# EAGLE board XMICRO-SERIAL V1.1 (EAGLE 6.3)
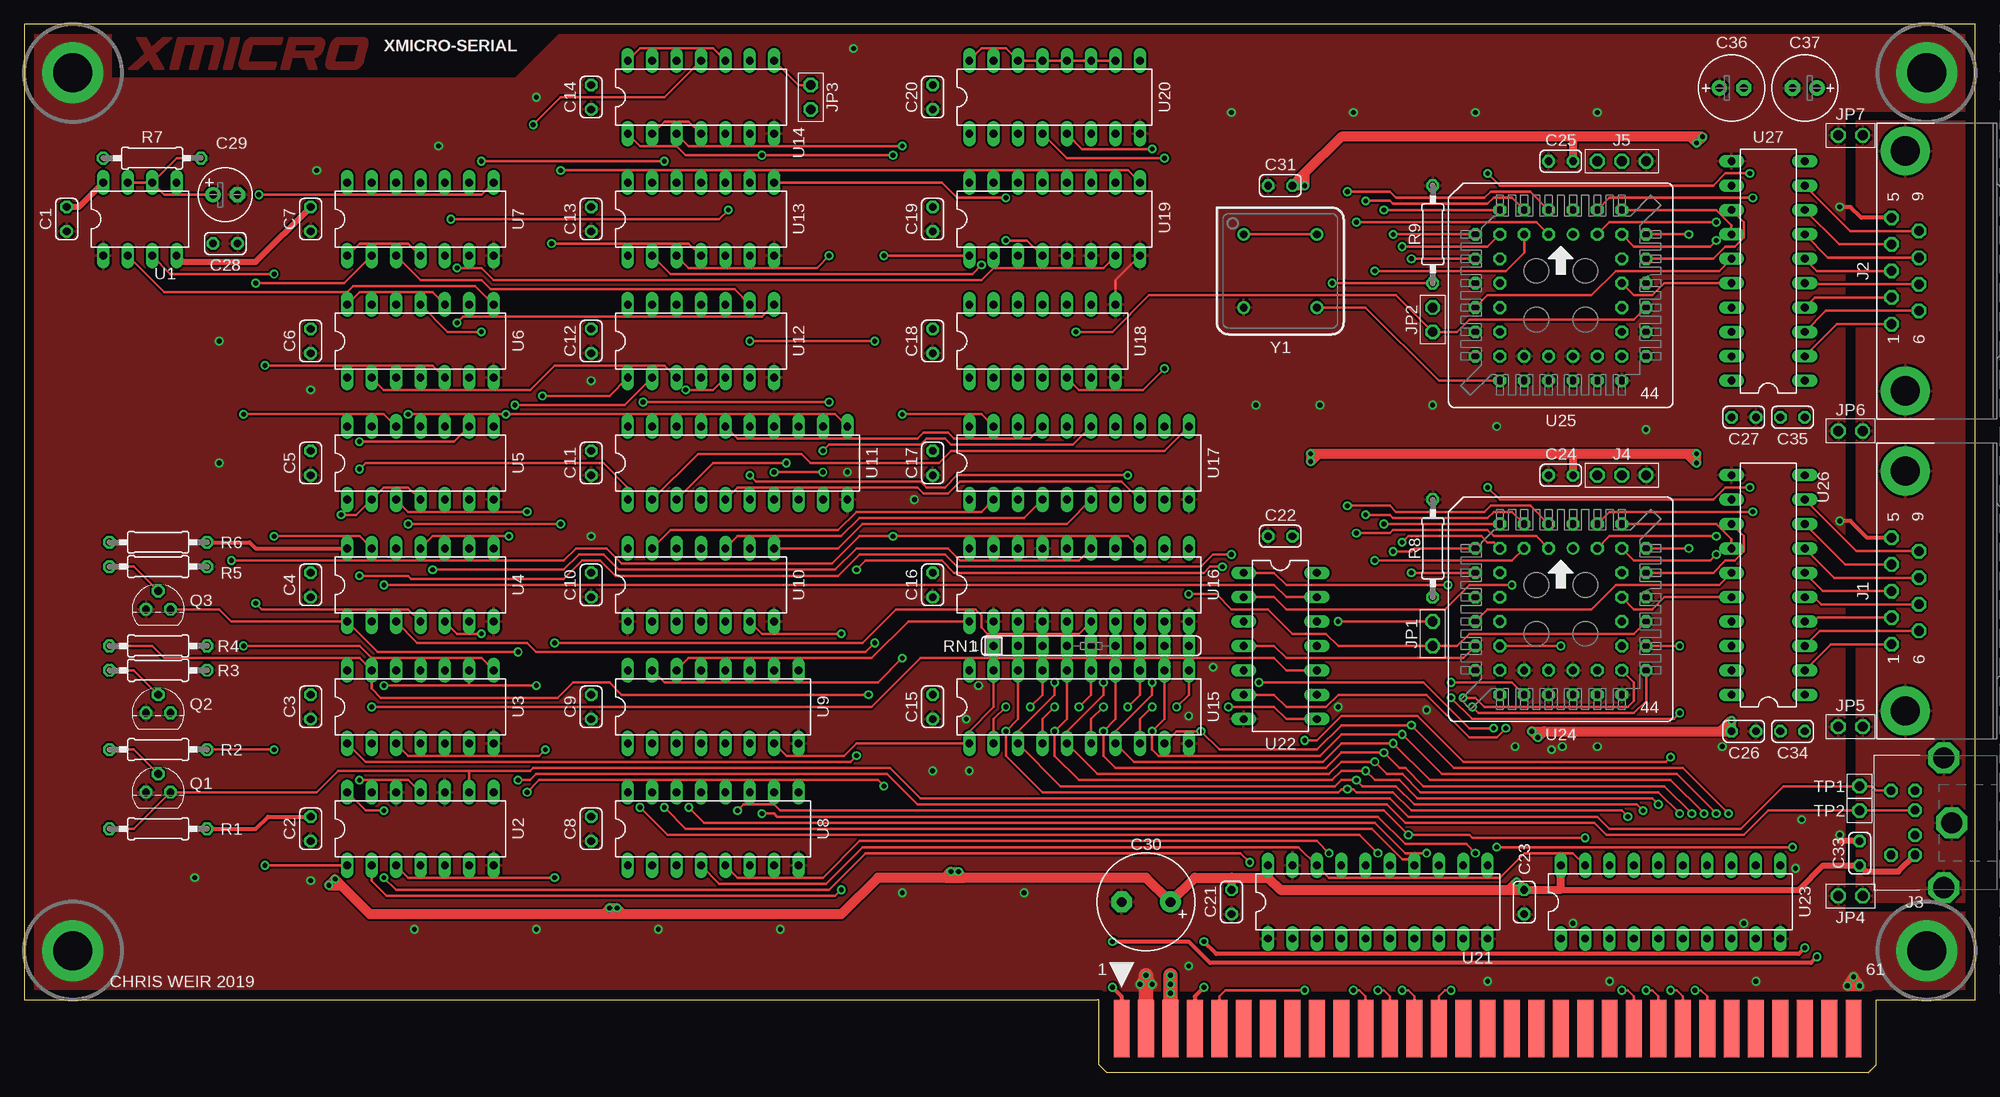
[diagram p6: board, top side]
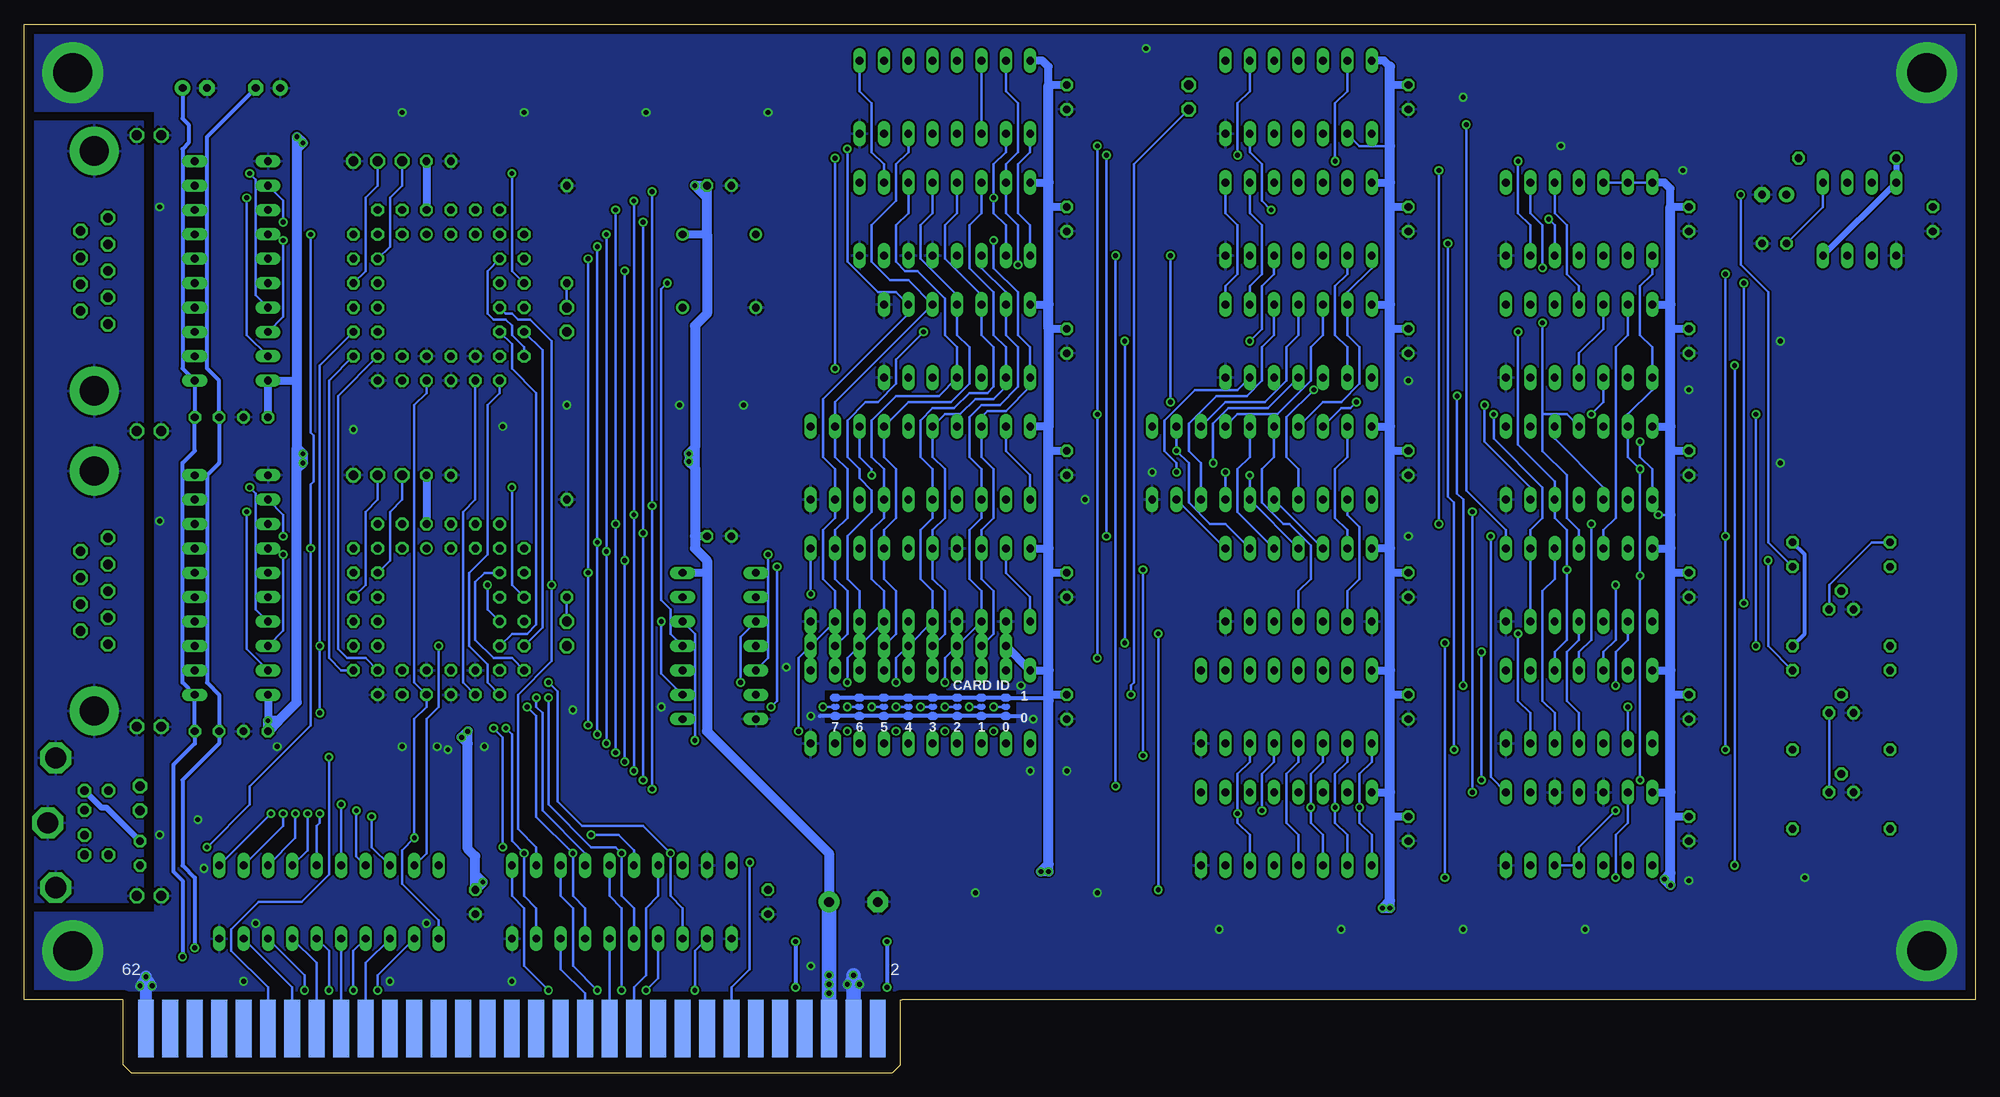
[diagram p7: board, bottom side, seen from below]

Size 203.2 x 109.22 mm. Coordinates in mm from the lower left corner, seen from the top.
Outline: 111.76,7.62 0,7.62 0,109.22 203.2,109.22 203.2,7.62 193.04,7.62
Copper layers (1*16): Top 0.035mm / dielectric 1.5mm / Bottom 0.035mm
Design rules "default *": minimum track width 6mil, minimum drill 0.3mm, track to track 8mil, track to pad 8mil, pad to pad 8mil, via to via 8mil, smd to smd 8mil, copper to edge 40mil, drill to drill 10mil, minimum pad ring 10mil, minimum via ring 8mil, stop-mask expansion 3mil, vias tented up to drill 30mil, thermal gap 10mil
Net classes: 0 default: width 0.254 mm; 1 GND: width 0.254 mm, clearance 0.254 mm to class 0; 2 SHIELD: width 0.254 mm, clearance 0.762 mm to class 0, clearance 0.762 mm to class 1; 3 SUPPLY: width 0.254 mm, clearance 0.381 mm to class 0, clearance 0.381 mm to class 1, clearance 0.762 mm to class 2, clearance 0.381 mm; 4 LOGO: width 0.152 mm
bRestrict: area 100,36.5 to 119.7,39.7

## Footprints (pad centres in the part's own frame; a part is rotated, then mirrored left to right if it is on the bottom)
C100 = drill 0.8 octagon: P$1 -1.27,0; P$2 1.27,0
E2,5-6 = drill 0.813 pad 1.6: + -1.27,0 | drill 0.813 pad 1.6 octagon: - 1.27,0
C-10-5 = drill 1.016 pad 2.184: + -2.54,0 | drill 1.016 pad 2.184 octagon: - 2.54,0
E2,5-7 = drill 0.813 pad 1.6: + -1.27,0 | drill 0.813 pad 1.6 octagon: - 1.27,0
EDGE62M = smd 1.651 x 5.969: 1 -38.1,-3.01; 3 -35.56,-3.01; 5 -33.02,-3.01; 7 -30.48,-3.01; 9 -27.94,-3.01; 11 -25.4,-3.01; 13 -22.86,-3.01; 15 -20.32,-3.01; 17 -17.78,-3.01; 19 -15.24,-3.01; 21 -12.7,-3.01; 23 -10.16,-3.01; 25 -7.62,-3.01; 27 -5.08,-3.01; 29 -2.54,-3.01; 31 0,-3.01; 33 2.54,-3.01; 35 5.08,-3.01; 37 7.62,-3.01; 39 10.16,-3.01; 41 12.7,-3.01; 43 15.24,-3.01; 45 17.78,-3.01; 47 20.32,-3.01; 49 22.86,-3.01; 51 25.4,-3.01; 53 27.94,-3.01; 55 30.48,-3.01; 57 33.02,-3.01; 59 35.56,-3.01; 61 38.1,-3.01 | smd 1.651 x 5.969 bottom: 2 -38.1,-3.01; 4 -35.56,-3.01; 6 -33.02,-3.01; 8 -30.48,-3.01; 10 -27.94,-3.01; 12 -25.4,-3.01; 14 -22.86,-3.01; 16 -20.32,-3.01; 18 -17.78,-3.01; 20 -15.24,-3.01; 22 -12.7,-3.01; 24 -10.16,-3.01; 26 -7.62,-3.01; 28 -5.08,-3.01; 30 -2.54,-3.01; 32 0,-3.01; 34 2.54,-3.01; 36 5.08,-3.01; 38 7.62,-3.01; 40 10.16,-3.01; 42 12.7,-3.01; 44 15.24,-3.01; 46 17.78,-3.01; 48 20.32,-3.01; 50 22.86,-3.01; 52 25.4,-3.01; 54 27.94,-3.01; 56 30.48,-3.01; 58 33.02,-3.01; 60 35.56,-3.01; 62 38.1,-3.01
D9-H = drill 1 octagon: P$1 -5.54,1.42; P$2 -2.77,1.42; P$3 0,1.42; P$4 2.77,1.42; P$5 5.54,1.42; P$6 -4.155,-1.42; P$7 -1.385,-1.42; P$8 1.385,-1.42; P$9 4.155,-1.42 | drill 3.05 pad 5.08: S1 -12.495,0; S2 12.495,0
MINI-DIN6 = drill 0.9 octagon: 1 -1.3,-2.16; 2 1.3,-2.16; 3 -3.35,-2.16; 4 3.35,-2.16; 5 -3.35,-4.65; 6 3.35,-4.65 | drill 2.2 octagon: G$1 6.76,0.84; G$2 -6.76,0.84; G$3 0,1.65
1X03 = drill 1.016 octagon: 1 -2.54,0; 2 0,0; 3 2.54,0
1X02 = drill 1.016 octagon: 1 -1.27,0; 2 1.27,0
TO92 = drill 0.813 octagon: 1 -1.27,0; 2 0,1.905; 3 1.27,0
0207/10 = drill 0.813 octagon: 1 -5.08,0; 2 5.08,0
SIL9 = drill 0.813 long: 1 -10.16,0; 2 -7.62,0; 3 -5.08,0; 4 -2.54,0; 5 0,0; 6 2.54,0; 7 5.08,0; 8 7.62,0; 9 10.16,0
1X01 = drill 1.016 octagon: 1 0,0
DIL-08 = drill 0.813 long: 1 -3.81,-3.81; 2 -1.27,-3.81; 3 1.27,-3.81; 4 3.81,-3.81; 5 3.81,3.81; 6 1.27,3.81; 7 -1.27,3.81; 8 -3.81,3.81
DIL14 = drill 0.813 long: 1 -7.62,-3.81; 2 -5.08,-3.81; 3 -2.54,-3.81; 4 0,-3.81; 5 2.54,-3.81; 6 5.08,-3.81; 7 7.62,-3.81; 8 7.62,3.81; 9 5.08,3.81; 10 2.54,3.81; 11 0,3.81; 12 -2.54,3.81; 13 -5.08,3.81; 14 -7.62,3.81
DIL16 = drill 0.813 long: 1 -8.89,-3.81; 2 -6.35,-3.81; 3 -3.81,-3.81; 4 -1.27,-3.81; 5 1.27,-3.81; 6 3.81,-3.81; 7 6.35,-3.81; 8 8.89,-3.81; 9 8.89,3.81; 10 6.35,3.81; 11 3.81,3.81; 12 1.27,3.81; 13 -1.27,3.81; 14 -3.81,3.81; 15 -6.35,3.81; 16 -8.89,3.81
DIL20 = drill 0.813 long: 1 -11.43,-3.81; 2 -8.89,-3.81; 3 -6.35,-3.81; 4 -3.81,-3.81; 5 -1.27,-3.81; 6 1.27,-3.81; 7 3.81,-3.81; 8 6.35,-3.81; 9 8.89,-3.81; 10 11.43,-3.81; 11 11.43,3.81; 12 8.89,3.81; 13 6.35,3.81; 14 3.81,3.81; 15 1.27,3.81; 16 -1.27,3.81; 17 -3.81,3.81; 18 -6.35,3.81; 19 -8.89,3.81; 20 -11.43,3.81
S44 = drill 0.813: 1 1.27,6.35 | drill 0.813 octagon: 2 -1.27,8.89; 3 -1.27,6.35; 4 -3.81,8.89; 5 -3.81,6.35; 6 -6.35,8.89; 7 -8.89,6.35; 8 -6.35,6.35; 9 -8.89,3.81; 10 -6.35,3.81; 11 -8.89,1.27; 12 -6.35,1.27; 13 -8.89,-1.27; 14 -6.35,-1.27; 15 -8.89,-3.81; 16 -6.35,-3.81; 17 -8.89,-6.35; 18 -6.35,-8.89; 19 -6.35,-6.35; 20 -3.81,-8.89; 21 -3.81,-6.35; 22 -1.27,-8.89; 23 -1.27,-6.35; 24 1.27,-8.89; 25 1.27,-6.35; 26 3.81,-8.89; 27 3.81,-6.35; 28 6.35,-8.89; 29 8.89,-6.35; 30 6.35,-6.35; 31 8.89,-3.81; 32 6.35,-3.81; 33 8.89,-1.27; 34 6.35,-1.27; 35 8.89,1.27; 36 6.35,1.27; 37 8.89,3.81; 38 6.35,3.81; 39 8.89,6.35; 40 6.35,8.89; 41 6.35,6.35; 42 3.81,8.89; 43 3.81,6.35; 44 1.27,8.89
DIL08S = drill 0.813: 1 -3.81,-3.81; 4 3.81,-3.81; 5 3.81,3.81; 8 -3.81,3.81

## Placement (x,y rotation side)
C1  0.1uF  [C100]  4.45,88.9 270 top
C2  0.1uF  [C100]  29.84,25.4 270 top
C3  0.1uF  [C100]  29.84,38.1 270 top
C4  0.1uF  [C100]  29.84,50.8 270 top
C5  0.1uF  [C100]  29.84,63.5 270 top
C6  0.1uF  [C100]  29.84,76.2 270 top
C7  0.1uF  [C100]  29.84,88.9 270 top
C8  0.1uF  [C100]  59.05,25.4 270 top
C9  0.1uF  [C100]  59.05,38.1 270 top
C10  0.1uF  [C100]  59.05,50.8 270 top
C11  0.1uF  [C100]  59.05,63.5 270 top
C12  0.1uF  [C100]  59.05,76.2 270 top
C13  0.1uF  [C100]  59.05,88.9 270 top
C14  0.1uF  [C100]  59.05,101.6 270 top
C15  0.1uF  [C100]  94.61,38.1 270 top
C16  0.1uF  [C100]  94.61,50.8 270 top
C17  0.1uF  [C100]  94.61,63.5 270 top
C18  0.1uF  [C100]  94.61,76.2 270 top
C19  0.1uF  [C100]  94.61,88.9 270 top
C20  0.1uF  [C100]  94.61,101.6 270 top
C21  0.1uF  [C100]  125.73,17.78 270 top
C22  0.1uF  [C100]  130.81,55.88 180 top
C23  0.1uF  [C100]  156.21,17.78 270 top
C24  0.1uF  [C100]  160.02,62.23 180 top
C25  0.1uF  [C100]  160.02,94.93 180 top
C26  0.1uF  [C100]  179.07,35.56 0 top
C27  0.1uF  [C100]  179.07,68.26 0 top
C28  10nF  [C100]  20.95,86.36 0 top
C29  0.1uF  [E2,5-6]  20.95,91.44 0 top
C30  220uF  [C-10-5]  116.84,17.78 180 top
C31  0.1uF  [C100]  130.81,92.39 180 top
C33  0.1uF  [C100]  191.13,22.86 90 top
C34  0.1uF  [C100]  184.15,35.56 180 top
C35  0.1uF  [C100]  184.15,68.26 180 top
C36  100uF  [E2,5-7]  177.8,102.55 0 top
C37  100uF  [E2,5-7]  185.42,102.55 180 top
CE0  XMICRO-BUS-EDGE62M  [EDGE62M]  152.4,7.62 0 top
J1  D9-MPH  [D9-H]  195.9,50.16 90 top
J2  D9-MPH  [D9-H]  195.9,83.5 90 top
J3  MINI-DIN6  [MINI-DIN6]  199.07,26.04 270 top
J4  PINHD1X3  [1X03]  166.37,62.23 0 top
J5  PINHD1X3  [1X03]  166.37,94.93 0 top
JP1  PINHD-1X2THRU  [1X02]  146.69,45.72 90 top
JP2  PINHD-1X2THRU  [1X02]  146.69,78.42 90 top
JP3  PINHD-1X2THRU  [1X02]  81.92,101.6 270 top
JP4  PINHD-1X2THRU  [1X02]  190.18,18.41 0 top
JP5  PINHD-1X2THRU  [1X02]  190.18,36.04 0 top
JP6  PINHD-1X2THRU  [1X02]  190.18,66.83 0 top
JP7  PINHD-1X2THRU  [1X02]  190.18,97.63 0 top
Q1  2N5088  [TO92]  13.97,29.21 0 top
Q2  2N5088  [TO92]  13.97,37.46 0 top
Q3  2N5088  [TO92]  13.97,48.26 0 top
R1  10k  [0207/10]  13.97,25.4 0 top
R2  100k  [0207/10]  13.97,33.66 180 top
R3  100k  [0207/10]  13.97,41.91 180 top
R4  10k  [0207/10]  13.97,44.45 0 top
R5  100k  [0207/10]  13.97,52.7 180 top
R6  10k  [0207/10]  13.97,55.24 0 top
R7  1.2k  [0207/10]  13.34,95.25 0 top
R8  10k  [0207/10]  146.69,54.61 270 top
R9  10k  [0207/10]  146.69,87.31 270 top
RN1  10k  [SIL9]  111.12,44.45 0 top
TP1  PINHD-1X1  [1X01]  191.13,29.85 90 top
TP2  PINHD-1X1  [1X01]  191.13,27.3 90 top
U1  555  [DIL-08]  12.06,88.9 0 top
U2  7486  [DIL14]  41.27,25.4 0 top
U3  7410  [DIL14]  41.27,38.1 0 top
U4  7404  [DIL14]  41.27,50.8 0 top
U5  7474  [DIL14]  41.27,63.5 0 top
U6  7474  [DIL14]  41.27,76.2 0 top
U7  7408  [DIL14]  41.27,88.9 0 top
U8  74138  [DIL16]  71.75,25.4 0 top
U9  74138  [DIL16]  71.75,38.1 0 top
U10  74280  [DIL14]  70.48,50.8 0 top
U11  74273  [DIL20]  74.3,63.5 0 top
U12  74164  [DIL14]  70.48,76.2 0 top
U13  74164  [DIL14]  70.48,88.9 0 top
U14  7474  [DIL14]  70.48,101.6 0 top
U15  74244  [DIL20]  109.86,38.1 0 top
U16  74244  [DIL20]  109.86,50.8 0 top
U17  74240  [DIL20]  109.86,63.5 0 top
U18  74280  [DIL14]  106.05,76.2 0 top
U19  74165  [DIL16]  107.31,88.9 0 top
U20  74165  [DIL16]  107.31,101.6 0 top
U21  74244  [DIL20]  140.97,17.78 0 top
U22  7404  [DIL14]  130.81,44.45 270 top
U23  74245  [DIL20]  171.45,17.78 0 top
U24  16550  [S44]  160.02,48.26 0 top
U25  16550  [S44]  160.02,80.96 0 top
U26  75185  [DIL20]  181.61,50.8 90 top
U27  75185  [DIL20]  181.61,83.5 90 top
Y1  1.8432MHz  [DIL08S]  130.81,83.5 270 top

## Tracks (layer width: path | path; a pad name or v marks a point on that pad's centre or on a via)
!BCSX  (via drill 0.5)
  Top 0.254: CE0.9 124.46,7.94 125.09,8.57 v133.35,8.57
  Bottom 0.254: v133.35,8.57 133.35,12.7 U21.2
!BRD  (via drill 0.5)
  Top 0.254: CE0.21 139.7,7.94 139.06,8.57 v138.43,8.57
  Bottom 0.254: v138.43,8.57 137.16,9.84 U21.4
!BRST  (via drill 0.5)
  Top 0.254: v127.64,21.91 126.68,22.86 87.63,22.86 83.82,19.05 38.73,19.05 v37.47,20.32
  Bottom 0.254: CE0.14 129.54,8.89 127.64,10.79 v127.64,21.91 | v37.47,20.32 37.47,24.77 36.2,26.04 U2.13
!BWR
  Bottom 0.254: CE0.22 139.7,8.89 138.43,10.16 138.43,17.14 137.16,18.41 U21.17
!CS_IDR
  Top 0.254: U15.19 100.97,38.1 98.42,35.56 U15.1 86.68,34.29 85.41,33.02 79.38,33.02 U9.7
!CS_KBR  (via drill 0.5)
  Top 0.254: U14.3 69.22,96.52 v91.44,96.52 | v91.44,68.58 99.69,68.58 U17.19 | U9.15 66.67,40.64 88.9,40.64 v91.44,43.18
  Bottom 0.254: v91.44,96.52 v91.44,68.58 v91.44,43.18 | U17.1 98.42,62.23 100.97,64.77 U17.19
!CS_KBW  (via drill 0.5)
  Top 0.254: U8.15 65.41,30.48 | 65.41,30.48 88.9,30.48 v89.53,29.85 | v89.53,85.09 U19.1 | U5.3 40.01,58.42 v52.39,58.42 | v52.39,29.21 53.66,30.48 65.41,30.48
  Bottom 0.254: U19.1 98.42,88.27 99.69,89.54 99.69,94.62 98.42,95.89 U20.1 | v89.53,29.85 v89.53,85.09 | U5.3 38.73,60.96 43.81,66.04 U5.10 | v52.39,58.42 v52.39,29.21
!CS_STR
  Top 0.254: U16.1 92.08,46.99 88.27,43.18 69.22,43.18 U9.14
  Bottom 0.254: U16.1 98.42,49.53 100.97,52.07 U16.19
!CSX  (via drill 0.5)
  Top 0.254: v160.02,44.45 U24.16 | U23.19 161.29,22.86 156.21,22.86 153.67,20.32 135.89,20.32 U21.18 132.72,23.5 87.31,23.5 83.5,19.68 72.39,19.68 U8.4
  Bottom 0.254: U9.4 70.48,32.38 71.75,31.12 71.75,26.04 70.48,24.77 U8.4 | U25.16 152.4,75.88 152.4,73.34 149.86,70.8 149.86,46.67 150.81,45.72 152.4,45.72 U24.16 | U23.19 161.29,22.86 161.29,36.83 160.02,38.1 v160.02,44.45
!INT_KB
  Top 0.254: U14.8 80.64,102.87 JP3.1
!IRQX  (via drill 0.5)
  Top 0.254: v133.35,34.61 134.62,34.61 137.16,37.15 145.1,37.15 149.86,32.38 170.97,32.38 v171.45,32.86
  Bottom 0.254: CE0.52 177.8,8.89 181.61,12.7 181.61,14.92 178.75,17.78 174.31,17.78 171.45,20.64 v171.45,32.86 | v133.35,34.61 133.35,45.72 U22.12
!KB_DATA  (via drill 0.5)
  Top 0.254: U12.1 60.96,70.48 v53.98,70.48 | v37.47,40.32 46.35,40.32 | 46.35,40.32 U3.9 | v53.34,40.32 46.35,40.32
  Bottom 0.254: U4.2 36.2,45.09 37.47,43.81 v37.47,40.32 | v53.98,70.48 53.98,60.32 53.34,59.69 v53.34,40.32
!KB_WRCYCLE  (via drill 0.5)
  Top 0.254: U13.2 67.31,83.19 98.74,83.19 v99.69,84.14 | U12.2 62.55,69.53 v51.12,69.53
  Bottom 0.254: U20.15 100.97,102.23 99.69,100.97 99.69,95.89 100.97,94.62 U19.15 100.97,89.54 99.69,88.27 v99.69,84.14 | U12.2 65.41,75.56 66.67,76.84 66.67,81.92 65.41,83.19 U13.2 | v51.12,69.53 51.12,65.72 46.35,60.96 U5.6
!RD  (via drill 0.5)
  Top 0.254: v162.56,24.45 150.81,24.45 150.5,24.77 v144.15,24.77 141.6,27.3 78.74,27.3 78.11,27.94 74.93,27.94 v74.3,27.3
  Bottom 0.254: U25.24 161.29,70.8 162.56,69.53 162.56,40.64 U24.24 161.29,38.1 162.56,36.83 v162.56,24.45 163.83,23.18 163.83,19.68 160.02,15.88 U23.1 | v144.15,24.77 141.29,24.77 139.7,23.18 U21.16 | U9.5 73.03,32.38 74.3,31.12 v74.3,27.3
!RST  (via drill 0.5)
  Top 0.254: U7.1 34.92,86.36 40.01,86.36 U7.4 | U11.1 62.87,60.96 60.33,63.5 35.56,63.5 v34.92,62.86 | v34.92,30.48 40.01,30.48 U2.11 | v125.73,53.97 123.83,53.97 122.56,52.7 97.16,52.7 95.89,53.97 87,53.97 84.77,51.75 61.59,51.75 60.01,53.34 58.1,53.34 56.2,51.43 40.32,51.43 40.01,51.75 v34.92,51.75
  Bottom 0.254: U7.1 33.66,83.19 34.92,81.92 34.92,76.84 33.66,75.56 U6.1 33.66,71.12 36.2,68.58 U5.13 36.2,64.14 v34.92,62.86 v34.92,51.75 v34.92,30.48 | U22.5 125.73,43.18 v125.73,53.97
!WR  (via drill 0.5)
  Top 0.254: v148.59,40.64 154.94,40.64 U24.20 | v135.89,22.86 134.62,24.13 87,24.13 83.19,20.32 74.3,20.32 U8.5
  Bottom 0.254: U21.3 134.62,17.14 135.89,18.41 v135.89,22.86 138.75,25.72 145.1,25.72 147.64,28.26 147.64,39.69 v148.59,40.64 | U25.20 156.21,59.69 157.48,58.42 157.48,40.64 U24.20
+12V  (via drill 0.5)
  Top 0.406: v186.69,12.07 186.06,11.43 123.51,11.43 121.28,13.65 v113.35,13.65 | v113.35,8.89 114.3,7.94 CE0.1
  Bottom 0.406: v186.69,12.07 186.69,20 187.64,20.96 187.64,32.07 185.42,34.29 C34.P$1 U26.1 186.69,40.64 186.69,63.5 185.42,64.77 C35.P$1 U27.1 186.69,73.34 186.69,96.2 186.06,96.84 186.06,98.74 186.69,99.38 C37.+ | v113.35,13.65 v113.35,8.89
-12V  (via drill 0.5)
  Top 0.406: v185.42,13.02 184.78,12.38 124.14,12.38 v122.87,13.65 | v122.87,8.89 121.92,7.94 CE0.7
  Bottom 0.406: 184.15,94.93 184.15,73.34 182.88,72.07 C35.P$2 182.88,63.5 184.15,62.23 | U26.10 184.15,62.23 | 184.15,62.23 184.15,40.64 182.88,39.37 C34.P$2 182.88,34.29 186.69,30.48 186.69,21.59 185.42,20.32 v185.42,13.02 | v122.87,13.65 v122.87,8.89 | U27.10 184.15,94.93 | 184.15,94.93 184.15,97.47 C36.-
A0  (via drill 0.5)
  Top 0.254: v172.4,44.45 U24.31 | v148.59,39.05 150.81,36.83 171.77,36.83 v172.4,37.46 | v140.97,22.86 139.06,24.77 66.99,24.77 v64.14,27.62
  Bottom 0.254: U9.1 62.87,32.38 64.14,31.12 v64.14,27.62 64.14,26.04 62.87,24.77 U8.1 | U21.5 139.7,17.14 140.97,18.41 v140.97,22.86 141.6,23.5 144.15,23.5 148.59,27.94 v148.59,39.05 | v172.4,37.46 v172.4,44.45 172.4,73.66 U25.31
A1  (via drill 0.5)
  Top 0.254: v149.86,39.05 151.13,39.05 152.08,38.1 167,38.1 167.64,38.73 167.64,40.64 U24.30 | U21.14 144.15,22.23 143.51,22.23 140.34,25.4 68.9,25.4 v66.67,27.62
  Bottom 0.254: U9.2 65.41,32.38 66.67,31.12 v66.67,27.62 66.67,26.04 65.41,24.77 U8.2 | v149.86,39.05 149.86,38.1 149.22,37.46 149.22,27.3 144.78,22.86 U21.14 | U24.30 167.64,43.18 169.54,43.18 170.5,44.13 170.5,70.48 U25.30
A2  (via drill 0.5)
  Top 0.254: v150.81,38.1 151.45,37.46 167.64,37.46 168.91,38.73 U24.29 | v146.05,22.86 143.83,22.86 140.65,26.04 70.8,26.04 v69.22,27.62
  Bottom 0.254: U8.3 67.94,24.77 69.22,26.04 v69.22,27.62 69.22,31.12 67.94,32.38 U9.3 | U21.7 144.78,17.14 146.05,18.41 v146.05,22.86 149.86,26.67 149.86,37.15 v150.81,38.1 | U25.29 171.45,72.07 171.45,43.18 170.18,41.91 U24.29
A3  (via drill 0.5)
  Top 0.254: U22.1 130.18,52.07 131.44,50.8 v148.27,50.8
  Bottom 0.254: U21.12 149.86,23.5 151.76,25.4 151.76,39.37 148.27,42.86 v148.27,50.8 148.27,76.2 150.5,78.42 151.76,78.42 152.4,79.06 153.03,79.06 U25.14
A4  (via drill 0.5)
  Top 0.254: v153.03,35.88 150.5,35.88 145.73,40.64 v128.59,40.64 | v151.13,22.86 150.18,23.81 143.83,23.81 140.97,26.67 78.42,26.67 78.11,26.99 v76.83,26.99
  Bottom 0.254: U8.6 75.56,24.77 76.83,26.04 v76.83,26.99 76.83,31.12 75.56,32.38 U9.6 | U21.9 149.86,17.14 151.13,18.41 v151.13,22.86 152.4,24.13 152.4,35.24 v153.03,35.88 | U22.3 128.59,45.4 v128.59,40.64
BA0  (via drill 0.5)
  Top 0.254: CE0.23 142.24,7.94 141.6,8.57 v140.97,8.57
  Bottom 0.254: v140.97,8.57 140.97,17.14 142.24,18.41 U21.15
BA1
  Bottom 0.254: CE0.24 U21.6
BA2  (via drill 0.5)
  Top 0.254: CE0.25 144.78,7.94 144.15,8.57 v143.51,8.57
  Bottom 0.254: v143.51,8.57 146.05,11.11 146.05,17.14 147.32,18.41 U21.13
BA3
  Bottom 0.254: CE0.26 144.78,8.26 147.32,10.79 U21.8
BA4  (via drill 0.5)
  Top 0.254: CE0.27 147.32,7.94 147.96,8.57 v148.59,8.57
  Bottom 0.254: v148.59,8.57 151.13,11.11 151.13,17.14 152.4,18.41 U21.11
BUFF_KB_CLOCK  (via drill 0.5)
  Top 0.254: U13.8 95.57,92.71 97.16,91.12 v102.23,91.12 | v45.09,78.11 45.72,78.74 76.83,78.74 U12.8 | v50.48,55.88 42.55,55.88 U4.11
  Bottom 0.254: U19.2 100.97,88.27 102.23,89.54 v102.23,91.12 102.23,94.62 100.97,95.89 U20.2 | U12.8 78.11,81.92 76.83,83.19 76.83,88.27 78.11,89.54 U13.8 | U4.11 41.27,56.52 42.55,57.78 42.55,62.23 45.09,64.77 45.09,68.58 | 45.09,68.58 v45.09,78.11 | U5.11 42.55,68.58 45.09,68.58 | U2.8 50.48,30.8 v50.48,55.88
D0  (via drill 0.5)
  Top 0.254: U15.18 103.5,36.83 v102.23,35.56 102.23,33.02 106.05,29.21 136.84,29.21 137.16,29.53 v137.79,29.53 138.43,29.53 138.75,29.21 142.56,29.21 144.46,27.3 166.37,27.3 v167,26.67 | v102.23,86.68 104.46,86.68 U19.4 | U25.2 156.84,91.76 152.72,91.76 152.08,91.12 142.88,91.12 142.24,91.76 v137.79,91.76 | U24.2 156.84,59.05 152.72,59.05 152.08,58.42 142.88,58.42 142.24,59.05 v137.79,59.05
  Bottom 0.254: v102.23,86.68 102.23,83.82 99.69,81.28 99.69,76.84 98.42,75.56 U18.1 98.42,71.44 100.97,68.9 102.87,68.9 103.5,68.26 U17.18 103.5,64.14 102.23,62.86 102.23,57.78 103.5,56.52 U16.18 103.5,51.43 102.23,50.16 102.23,45.72 RN1.2 U15.18 | v137.79,29.53 v137.79,59.05 v137.79,91.76 | U23.18 167,23.5 v167,26.67
D1  (via drill 0.5)
  Top 0.254: v107.31,40.64 107.31,39.37 103.5,35.56 U15.3 107.95,29.85 136.53,29.85 137.16,30.48 v138.75,30.48 139.38,29.85 142.88,29.85 144.78,27.94 167.96,27.94 v168.59,27.3 | U25.3 157.48,88.58 v138.75,88.58 | U24.3 157.48,55.88 153.03,55.88 152.4,56.52 142.56,56.52 142.24,56.2 v138.75,56.2
  Bottom 0.254: U19.3 103.5,83.82 100.97,81.28 U18.13 100.97,76.84 99.69,75.56 99.69,71.44 101.6,69.53 103.5,69.53 104.78,68.26 104.78,64.14 103.5,62.86 U17.3 103.5,57.78 104.78,56.52 104.78,51.43 103.5,50.16 U16.3 RN1.3 107.31,43.18 v107.31,40.64 | v138.75,30.48 v138.75,56.2 v138.75,88.58 | U23.17 168.59,22.54 v168.59,27.3
D2  (via drill 0.5)
  Top 0.254: U15.16 108.58,36.83 v107.31,35.56 107.31,33.02 109.86,30.48 136.21,30.48 137.16,31.43 v139.7,31.43 140.65,30.48 143.19,30.48 145.1,28.57 169.54,28.57 v170.18,27.94 | U25.4 154.94,91.12 153.03,91.12 152.4,90.49 142.56,90.49 142.24,90.81 v139.7,90.81 | U24.4 154.94,58.42 153.03,58.42 152.4,57.78 142.56,57.78 142.24,58.1 v139.7,58.1
  Bottom 0.254: U19.14 103.5,89.54 104.78,88.27 104.78,83.82 102.23,81.28 102.23,76.84 100.97,75.56 U18.2 100.97,71.44 102.23,70.17 104.14,70.17 105.73,68.58 107.31,68.58 U17.16 108.58,64.14 107.31,62.86 107.31,57.78 108.58,56.52 U16.16 108.58,51.43 107.31,50.16 107.31,45.72 RN1.4 U15.16 | v139.7,31.43 v139.7,58.1 v139.7,90.81 | U23.16 v170.18,27.94
D3  (via drill 0.5)
  Top 0.254: v112.39,40.64 112.39,39.37 108.58,35.56 U15.5 111.76,31.12 135.89,31.12 137.16,32.38 v140.65,32.38 141.92,31.12 143.51,31.12 145.41,29.21 170.18,29.21 v172.4,26.99 | U25.5 156.21,85.41 154.31,83.5 v140.65,83.5 | U24.5 154.94,53.34 v140.65,53.34
  Bottom 0.254: U19.13 106.05,89.54 107.31,88.27 107.31,84.77 103.5,80.96 U18.12 103.5,76.84 102.23,75.56 102.23,71.44 102.87,70.8 104.78,70.8 106.36,69.22 108.58,69.22 109.86,67.95 109.86,64.14 108.58,62.86 U17.5 108.58,57.78 109.86,56.52 109.86,51.43 108.58,50.16 U16.5 RN1.5 112.39,43.18 v112.39,40.64 | v140.65,32.38 v140.65,53.34 v140.65,83.5 | U23.15 172.72,25.72 172.4,26.04 v172.4,26.99
D4  (via drill 0.5)
  Top 0.254: U15.14 113.67,36.83 v112.39,35.56 112.39,33.02 113.67,31.75 135.57,31.75 137.16,33.34 v141.6,33.34 143.19,31.75 143.83,31.75 145.73,29.85 170.81,29.85 v173.67,26.99 | U25.6 v141.6,89.85 | U24.6 v141.6,57.15
  Bottom 0.254: U19.12 108.58,89.54 109.86,88.27 109.86,84.77 106.05,80.96 U18.11 106.05,76.84 104.78,75.56 104.78,71.76 106.68,69.85 111.12,69.85 U17.14 113.67,64.14 112.39,62.86 112.39,57.78 113.67,56.52 U16.14 113.67,51.43 112.39,50.16 112.39,45.72 RN1.6 U15.14 | v141.6,33.34 v141.6,57.15 v141.6,89.85 | v173.67,26.99 173.67,23.18 U23.14
D5  (via drill 0.5)
  Top 0.254: v117.47,40.64 117.47,39.37 113.67,35.56 U15.7 115.57,32.38 135.25,32.38 137.16,34.29 v142.56,34.29 146.37,30.48 171.45,30.48 v174.94,26.99 | U25.7 v142.56,87.31 | U24.7 144.78,54.61 144.46,54.29 v142.56,54.29
  Bottom 0.254: U19.11 111.12,89.54 112.39,88.27 112.39,84.45 111.44,83.5 110.17,83.5 107.31,80.65 107.31,76.84 106.05,75.56 U18.4 107.95,70.48 112.39,70.48 114.94,67.95 114.94,64.14 113.67,62.86 U17.7 113.67,57.78 114.94,56.52 114.94,51.43 113.67,50.16 U16.7 RN1.7 117.47,43.18 v117.47,40.64 | v142.56,34.29 v142.56,54.29 v142.56,87.31 | v174.94,26.99 174.94,24.45 U23.13
D6  (via drill 0.5)
  Top 0.254: U15.12 118.75,36.83 v117.47,35.56 117.47,33.66 118.11,33.02 134.94,33.02 137.16,35.24 v143.51,35.24 147.64,31.12 172.09,31.12 v176.21,26.99 | U25.8 152.4,86.04 v143.51,86.04 | U24.8 153.03,55.24 152.4,55.24 151.76,55.88 144.15,55.88 v143.51,55.24
  Bottom 0.254: U20.6 111.12,95.89 112.39,94.62 112.39,90.81 114.94,88.27 114.94,84.45 113.03,82.55 111.12,82.55 U18.10 118.75,69.85 U17.12 118.75,64.14 117.47,62.86 117.47,57.78 118.75,56.52 U16.12 118.75,51.43 117.47,50.16 117.47,45.72 RN1.8 U15.12 | v143.51,35.24 v143.51,55.24 v143.51,86.04 | v176.21,26.99 176.21,25.72 U23.12
D7  (via drill 0.5)
  Top 0.254: v144.46,84.77 U25.9 | U24.9 v144.46,52.07 | v177.48,26.99 172.72,31.75 148.91,31.75 v144.46,36.2 137.16,36.2 134.62,33.66 124.46,33.66 v122.56,35.56 120.02,35.56 U15.9 | U20.5 110.17,96.2 v117.47,96.2
  Bottom 0.254: v122.56,35.56 122.56,43.18 RN1.9 U16.9 118.75,50.16 120.02,51.43 120.02,56.52 118.75,57.78 U17.9 118.75,62.86 120.02,64.14 120.02,70.17 111.12,79.06 U18.9 112.39,81.28 114.3,81.28 117.47,84.45 v117.47,96.2 | v144.46,36.2 v144.46,52.07 v144.46,84.77 | v177.48,26.99 U23.11
GND  (via drill 0.5, 4.06 pad 6.35)
  Top 0.254: U18.8 113.67,82.55 U19.8
  Top 0.406: J1.P$5 191.94,55.7 190.18,57.47 v189.07,57.47 | J2.P$5 191.31,89.04 190.18,90.17 v189.07,90.17
  Top 0.61: C33.P$2 189.07,24.13 v189.07,24.77
  Top 1.016: v117.47,9.21 v116.84,10.16 v116.2,9.21 v117.47,9.21 | v191.13,9.05 v190.5,10 v189.87,9.05 v191.13,9.05
  Top 1.524: v116.84,10.16 CE0.3
  Bottom 0.406: 101.12,37.15 103.35,37.15 | 103.66,37.15 105.89,37.15 | 106.2,37.15 108.43,37.15 | 108.74,37.15 110.97,37.15 | 111.28,37.15 113.51,37.15 | 113.82,37.15 116.05,37.15 | 116.36,37.15 118.59,37.15 | 118.9,37.15 120.33,37.15 | 100.81,37.15 99.38,37.15
  Bottom 0.61: J3.3 195.15,27.62 194.63,27.62 C33.P$2
  Bottom 0.813: 100.81,37.15 101.12,37.15 | 103.35,37.15 103.66,37.15 | 105.89,37.15 106.2,37.15 | 108.43,37.15 108.74,37.15 | 110.97,37.15 111.28,37.15 | 113.51,37.15 113.82,37.15 | 116.05,37.15 116.36,37.15 | 118.59,37.15 118.9,37.15
  Bottom 1.016: v116.84,10.16 v117.47,9.21 v116.2,9.21 v116.84,10.16 | v190.5,10 v191.13,9.05 v189.87,9.05 v190.5,10
  Bottom 1.27: CE0.62 v190.5,10
  Bottom 1.524: CE0.3 v116.84,10.16
  other vias: 5.08,12.7 198.12,104.14 5.08,104.14 98.11,36.83 198.12,12.7 92.71,59.69 160.18,33.97 159.07,33.66 176.85,33.97 185.1,26.35 99.38,40.32 59.05,55.88 85.72,62.55 59.05,72.07 29.84,71.12 94.61,31.43 98.42,31.43 78.74,14.92 91.44,18.73 104.14,18.73 66.04,14.92 53.34,14.92 40.64,14.92 29.84,20 17.78,20.32 20.32,63.5 20.32,76.2 30.48,93.98 43.18,96.52 53.34,101.6 86.36,106.68 125.73,100.01 138.43,100.01 151.13,100.01 163.83,100.01 128.27,69.53 134.94,69.53 146.69,69.53 136.84,38.1 146.05,37.78 163.83,33.97 121.28,37.15 153.35,67.31 168.91,66.99 123.83,42.23 155.26,33.97 161.29,15.56 179.07,15.56 184.47,21.27 121.28,11.11 152.4,9.53 165.1,9.53 180.34,9.53
  pour Top: 0,109.22 9.02,109.22 9.02,103.51 51.12,103.51 56.83,109.22 203.2,109.22 203.2,100.2 189.55,100.2 189.55,16.64 203.2,16.64 203.2,7.62 192.72,7.62 192.72,8.57 112.08,8.57 112.08,7.62 0,7.62
  pour Bottom: 0,109.22 203.2,109.22 203.2,100.2 189.55,100.2 189.55,16.64 203.2,16.64 203.2,7.62 192.72,7.62 192.72,8.57 112.08,8.57 112.08,7.62 0,7.62
ID0  (via drill 0.5)
  Top 0.254: U15.2 100.97,36.83 v102.23,38.1
  Bottom 0.254: v102.23,38.1 101.12,38.1
  Bottom 0.61: 101.12,38.1 100.81,38.1
ID1  (via drill 0.5)
  Top 0.254: U15.17 106.05,39.37 v104.78,38.1
  Bottom 0.254: v104.78,38.1 103.66,38.1
  Bottom 0.61: 103.66,38.1 103.35,38.1
ID2  (via drill 0.5)
  Top 0.254: U15.4 106.05,36.83 v107.31,38.1
  Bottom 0.254: v107.31,38.1 106.2,38.1
  Bottom 0.61: 106.2,38.1 105.89,38.1
ID3  (via drill 0.5)
  Top 0.254: U15.15 111.12,39.37 v109.86,38.1
  Bottom 0.254: v109.86,38.1 108.74,38.1
  Bottom 0.61: 108.74,38.1 108.43,38.1
ID4  (via drill 0.5)
  Top 0.254: U15.6 111.12,36.83 v112.39,38.1
  Bottom 0.254: v112.39,38.1 111.28,38.1
  Bottom 0.61: 111.28,38.1 110.97,38.1
ID5  (via drill 0.5)
  Top 0.254: U15.13 116.2,39.37 v114.94,38.1
  Bottom 0.254: v114.94,38.1 113.82,38.1
  Bottom 0.61: 113.82,38.1 113.51,38.1
ID6  (via drill 0.5)
  Top 0.254: U15.8 116.2,36.83 v117.47,38.1
  Bottom 0.254: v117.47,38.1 116.36,38.1
  Bottom 0.61: 116.36,38.1 116.05,38.1
ID7  (via drill 0.5)
  Top 0.254: U15.11 121.28,39.37 v120.02,38.1
  Bottom 0.254: v120.02,38.1 118.9,38.1
  Bottom 0.61: 118.9,38.1 118.59,38.1
INT_KB  (via drill 0.5)
  Top 0.254: U16.13 114.94,55.88 v90.49,55.88 87,55.88 84.14,53.02 62.23,53.02 60.64,54.61 57.47,54.61 56.2,53.34 v21.59,53.34 | U14.1 64.14,96.52 67.94,96.52 68.9,95.57 v76.83,95.57 v90.49,95.57
  Bottom 0.254: v90.49,95.57 v90.49,55.88 | v76.83,95.57 76.83,100.97 75.56,102.23 U14.9 | R3.1 21.59,44.45 v21.59,53.34
INT_UART1  (via drill 0.5)
  Top 0.254: U24.33 167.64,45.72 150.5,45.72 149.22,44.45 JP1.1 136.84,44.45 135.57,45.72 132.08,45.72 129.54,48.26 125.73,48.26 124.14,49.85 v121.28,49.85
  Bottom 0.254: v121.28,49.85 U16.11
INT_UART2  (via drill 0.5)
  Top 0.254: U25.33 167.64,78.42 150.5,78.42 149.22,77.15 JP2.1 142.88,80.96 117.16,80.96 113.35,77.15 v109.54,77.15
  Bottom 0.254: U16.8 116.2,50.16 117.47,51.43 117.47,55.88 114.94,58.42 114.94,60.64 116.2,61.91 116.2,62.86 117.47,64.14 117.47,67.95 115.57,69.85 114.3,69.85 112.39,71.76 112.39,74.3 v109.54,77.15
KB_CLOCK
  Top 0.254: 46.35,31.43 52.7,31.43 53.02,31.75 90.17,31.75 93.34,28.57 142.24,28.57 144.15,26.67 163.83,26.67 165.1,25.4 178.75,25.4 183.2,29.85 TP1.1 192.41,29.85 192.87,29.39 J3.5 | U2.9 46.35,31.43 | 46.35,31.43 32.7,31.43 30.48,29.21 Q1.3 11.43,25.4 R1.1
  Bottom 0.254: Q2.3 Q1.3
KB_DATA  (via drill 0.5)
  Top 0.254: v51.44,30.48 52.7,30.48 53.34,31.12 89.85,31.12 93.03,27.94 141.92,27.94 143.83,26.04 163.51,26.04 164.78,24.77 179.07,24.77 181.61,27.3 TP2.1 196.88,27.3 J3.1 | v51.44,43.81 36.83,43.81 U4.1 21.59,46.99 20.32,48.26 Q3.3
  Bottom 0.254: v51.44,30.48 v51.44,43.81 | R6.1 10.79,55.24 15.24,50.8 Q3.3
KB_ERR  (via drill 0.5)
  Top 0.254: U16.6 109.86,45.72 100.33,45.72 99.69,46.35 99.69,47.62 99.06,48.26 90.81,48.26 87.31,44.77 v55.24,44.77 | v55.24,20.32 40.01,20.32 U2.3
  Bottom 0.254: v55.24,44.77 v55.24,20.32
KB_WRCYCLE  (via drill 0.5)
  Top 0.254: U16.15 109.86,53.34 97.47,53.34 96.2,54.61 86.68,54.61 84.45,52.39 61.91,52.39 60.33,53.97 57.78,53.97 56.2,52.39 v42.55,52.39 | v47.62,77.15 44.13,77.15 U6.11
  Bottom 0.254: U3.10 43.81,43.81 42.55,45.09 v42.55,52.39 42.55,56.52 43.81,57.78 U5.5 43.81,61.59 47.62,65.41 v47.62,77.15 | U6.11 41.27,81.92 42.55,83.19 42.55,88.27 43.81,89.54 U7.10
LOGO
  pour Top: 26.95,107.79 26.78,107.1 23.79,107.1 23.31,105.22 26.28,105.22 26.12,104.53 22.83,104.53 arc-47 22.56,104.64 arc-36 22.42,104.96 arc-17 22.43,105.22 arc-5 22.46,105.37 22.86,106.95 arc-33 23.23,107.55 arc-31 23.61,107.78 arc-13 23.75,107.79
N$1
  Top 0.254: U26.2 188.13,44.62 J1.P$1
N$2
  Top 0.254: U26.4 186.37,46.99 186.78,47.39 J1.P$2
N$3
  Top 0.254: U26.6 187.32,50.16 J1.P$3
N$4
  Top 0.254: U26.8 189.63,52.93 J1.P$4
N$5
  Top 0.254: U26.3 186.98,46.01 J1.P$6
N$6
  Top 0.254: U26.5 186.37,49.53 187.12,48.78 J1.P$7
N$7
  Top 0.254: U26.7 188.48,51.55 J1.P$8
N$8
  Top 0.254: U26.9 190.79,54.32 J1.P$9
N$9
  Top 0.254: U27.2 188.77,77.96 J2.P$1
N$10  (via drill 0.5)
  Top 0.254: v176.21,55.88 165.1,55.88 U24.43
  Bottom 0.254: U26.12 176.21,58.1 v176.21,55.88
N$11
  Top 0.254: U24.37 175.9,52.07 177.16,53.34 178.12,53.34 179.07,54.29 179.07,55.88 U26.13
N$12
  Top 0.254: U24.40 176.21,57.15 177.8,55.56 U26.14
N$13
  Top 0.254: U24.13 152.4,48.26 163.19,48.26 165.74,50.8 176.53,50.8 U26.15
N$14
  Top 0.254: U26.16 170.81,49.53 169.54,48.26 167.64,48.26 U24.36
N$15  (via drill 0.5)
  Top 0.254: v152.4,60.96 153.67,59.69 175.9,59.69 177.16,60.96 v179.71,60.96
  Bottom 0.254: v152.4,60.96 152.4,50.8 U24.11 | v179.71,60.96 179.07,60.32 179.07,48.26 U26.17
N$16  (via drill 0.5)
  Top 0.254: U24.41 167.64,53.34 175.58,53.34 v176.21,53.97
  Bottom 0.254: v176.21,53.97 176.21,46.04 U26.18
N$17  (via drill 0.5)
  Top 0.254: v180.02,58.42 165.1,58.42 U24.42
  Bottom 0.254: U26.19 180.02,44.13 v180.02,58.42
N$18
  Bottom 0.254: U24.17 152.4,43.18 154.31,43.18 156.21,45.09 156.21,51.12 155.26,52.07 U24.10
N$19  (via drill 0.5)
  Top 0.254: U4.5 45.09,45.72 v47.62,45.72
  Bottom 0.254: v47.62,45.72 47.62,38.73 46.35,37.46 U3.6
N$20  (via drill 0.5)
  Top 0.254: U14.11 66.67,101.6 55.88,101.6 v53.02,98.74
  Bottom 0.254: v53.02,98.74 53.02,60.64 48.9,56.52 U4.8
N$21  (via drill 0.5)
  Top 0.254: U22.13 131.44,49.53 130.18,50.8 v37.47,50.8
  Bottom 0.254: v37.47,50.8 37.47,45.09 38.73,43.81 U3.12
N$22  (via drill 0.5)
  Top 0.254: U5.12 37.47,68.58 v22.86,68.58 | v22.86,44.45 34.92,44.45 36.2,43.18 47.62,43.18 U3.8
  Bottom 0.254: v22.86,68.58 v22.86,44.45
N$23
  Bottom 0.254: U4.12 38.73,56.52 37.47,57.78 37.47,75.56 36.2,76.84 U6.13
N$24  (via drill 0.5)
  Top 0.254: v87.95,39.37 62.23,39.37 60.96,40.64 57.15,40.64 55.56,39.05 37.15,39.05 36.2,40 U3.13 34.92,43.18 14.61,43.18 13.34,44.45 R4.1
  Bottom 0.254: v87.95,39.37 87.95,40.32 87.63,40.64 87.63,94.62 JP3.2
N$25  (via drill 0.5)
  Top 0.254: U22.8 131.44,36.83 130.18,38.1 v125.41,38.1 | v124.78,52.7 123.51,52.7 122.87,52.07 96.84,52.07 95.57,53.34 87.63,53.34 v86.68,52.39 | v86.68,33.02 86.04,32.38 35.56,32.38 U3.1
  Bottom 0.254: v125.41,38.1 124.78,38.73 v124.78,52.7 | v86.68,52.39 v86.68,33.02
N$26  (via drill 0.5)
  Top 0.254: v173.35,54.61 U24.39 | v184.15,23.5 v153.35,23.5 | U22.6 130.18,39.37 131.44,38.1 135.57,38.1 136.84,39.37 146.05,39.37 150.5,34.92 153.35,34.92 v154.31,35.88 | v173.35,87.31 U25.39
  Bottom 0.254: v173.35,87.31 173.35,66.67 173.04,66.36 173.04,61.59 173.35,61.28 v173.35,54.61 173.35,36.2 179.71,29.85 179.71,27.94 v184.15,23.5 | v153.35,23.5 153.35,34.92 v154.31,35.88
N$28
  Top 0.254: U27.4 186.46,80.73 J2.P$2
N$29
  Top 0.254: U27.6 186.69,83.5 J2.P$3
N$30
  Top 0.254: U27.8 189,86.27 J2.P$4
N$31
  Top 0.254: U27.3 187.62,79.35 J2.P$6
N$32
  Top 0.254: U27.5 186.37,82.23 186.49,82.12 J2.P$7
N$33
  Bottom 0.254: CE0.50 175.26,8.89 U23.9
N$34  (via drill 0.5)
  Top 0.254: CE0.49 175.26,7.94 174.62,8.57 v173.99,8.57
  Bottom 0.254: v173.99,8.57 173.99,10.16 U23.8
N$35
  Bottom 0.254: CE0.48 172.72,11.43 U23.7
N$36  (via drill 0.5)
  Top 0.254: CE0.47 172.72,7.94 172.09,8.57 v171.45,8.57
  Bottom 0.254: v171.45,8.57 171.45,12.7 U23.6
N$37
  Bottom 0.254: CE0.46 U23.5
N$38  (via drill 0.5)
  Top 0.254: CE0.45 170.18,7.94 169.54,8.57 v168.91,8.57
  Bottom 0.254: v168.91,8.57 168.91,12.7 U23.4
N$39
  Bottom 0.254: CE0.44 167.64,11.43 U23.3
N$40  (via drill 0.5)
  Top 0.254: CE0.43 167.64,7.94 167,8.57 v166.37,8.57
  Bottom 0.254: v166.37,8.57 166.37,10.16 U23.2
N$41
  Top 0.254: U27.7 187.84,84.89 J2.P$8
N$42
  Top 0.254: U27.9 190.16,87.66 J2.P$9
N$47  (via drill 0.5)
  Top 0.254: U25.43 165.1,88.58 v176.21,88.58
  Bottom 0.254: v176.21,88.58 176.21,90.81 U27.12
N$48
  Top 0.254: U25.37 175.9,84.77 177.16,86.04 178.12,86.04 179.07,87 179.07,88.58 U27.13
N$49
  Top 0.254: U25.40 176.21,89.85 177.8,88.27 U27.14
N$60
  Top 0.254: U27.15 176.53,83.5 165.74,83.5 163.19,80.96 152.4,80.96 U25.13
N$61
  Top 0.254: U27.16 170.81,82.23 169.54,80.96 167.64,80.96 U25.36
N$62  (via drill 0.5)
  Top 0.254: v152.4,93.66 153.67,92.39 175.9,92.39 177.16,93.66 v179.71,93.66
  Bottom 0.254: U25.11 152.4,83.5 v152.4,93.66 | v179.71,93.66 179.07,93.03 179.07,80.96 U27.17
N$63  (via drill 0.5)
  Top 0.254: U25.41 167.64,86.04 175.58,86.04 v176.21,86.68
  Bottom 0.254: v176.21,86.68 176.21,78.74 U27.18
N$64  (via drill 0.5)
  Top 0.254: U25.42 165.1,91.12 v180.02,91.12
  Bottom 0.254: v180.02,91.12 180.02,76.84 U27.19
N$65
  Bottom 0.254: U25.10 154.94,83.5 154.94,79.06 154.31,78.42 153.03,78.42 152.4,77.79 152.4,76.84 151.13,75.56 U25.17
N$66
  Bottom 0.254: U11.17 67.94,69.85 66.04,69.85 64.14,71.76 64.14,75.56 65.41,76.84 U12.13 65.41,81.28 62.87,83.82 U13.1
N$67  (via drill 0.5)
  Top 0.254: v83.82,85.09 82.55,83.82 69.22,83.82 U13.3 | v83.82,69.85 v64.45,69.85
  Bottom 0.254: v83.82,85.09 v83.82,69.85 | v64.45,69.85 65.09,69.22 66.04,69.22 U11.18
N$69  (via drill 0.5)
  Top 0.254: U4.3 40.96,44.77 52.39,44.77 53.34,43.81 87.63,43.81 v88.58,44.77 | v75.56,76.2 v88.58,76.2
  Bottom 0.254: U13.5 73.03,83.19 74.3,81.92 74.3,77.47 v75.56,76.2 | v88.58,76.2 v88.58,44.77
N$70  (via drill 0.5)
  Top 0.254: U7.2 33.34,82.23 v24.13,82.23 | v24.13,48.89 24.77,48.26 40.01,48.26 U4.4
  Bottom 0.254: U4.4 41.27,45.09 42.55,43.81 42.55,38.73 41.27,37.46 U3.4 | v24.13,82.23 v24.13,48.89
N$71  (via drill 0.5)
  Top 0.254: U11.11 84.45,68.58 v50.16,68.58 v40.01,68.58
  Bottom 0.254: U4.6 U4.9 46.35,56.52 45.09,57.78 45.09,60.96 50.16,66.04 v50.16,68.58 | v40.01,68.58 38.73,69.85 U6.3
N$72  (via drill 0.5)
  Top 0.254: U3.3 40.01,33.02 52.7,33.02 53.66,33.02 v54.29,33.66 | v54.93,86.36 69.22,86.36 U13.4
  Bottom 0.254: v54.29,33.66 54.29,59.37 54.93,60.01 v54.93,86.36
N$73
  Bottom 0.254: U11.14 76.83,68.58 72.71,68.58 69.22,72.07 69.22,75.56 67.94,76.84 U12.12
N$74
  Bottom 0.254: U11.13 78.11,69.85 73.98,69.85 71.75,72.07 71.75,75.56 70.48,76.84 U12.11
N$76  (via drill 0.5)
  Top 0.254: v83.19,62.55 v78.11,62.55
  Bottom 0.254: U12.6 76.83,71.12 81.28,71.12 84.45,67.95 84.45,64.77 83.19,63.5 v83.19,62.55 | v78.11,62.55 U11.7
N$77  (via drill 0.5)
  Top 0.254: v68.9,71.12 71.75,71.12 U12.5
  Bottom 0.254: U11.4 70.48,62.86 71.75,64.14 71.75,68.26 v68.9,71.12
N$78  (via drill 0.5)
  Top 0.254: v79.38,63.5 71.75,63.5 U11.3
  Bottom 0.254: U12.4 73.66,69.22 77.79,69.22 79.38,67.63 v79.38,63.5
N$79
  Top 0.254: U6.2 37.47,71.12 52.7,71.12 55.24,73.66 66.67,73.66 U12.3
N$81
  Top 0.254: U12.9 73.98,81.6 48.58,81.6 47.62,82.55 41.27,82.55 U7.3
  Bottom 0.254: U12.9 75.56,81.92 74.3,83.19 74.3,88.27 75.56,89.54 U13.9
N$82  (via drill 0.5)
  Top 0.254: v47.62,94.93 v66.67,94.93
  Bottom 0.254: U7.6 46.35,88.27 47.62,89.54 v47.62,94.93 | v66.67,94.93 66.67,100.97 65.41,102.23 U14.13
N$84  (via drill 0.5)
  Top 0.254: U6.5 42.55,73.66 v25.08,73.66 | v25.08,21.59 U2.1
  Bottom 0.254: v25.08,73.66 v25.08,21.59
N$86
  Top 0.254: U17.2 99.69,58.42 86.68,58.42 84.77,56.52 67.31,56.52 U10.13
  Bottom 0.254: U10.13 65.41,56.52 66.67,57.78 66.67,62.86 65.41,64.14 U11.19
N$87  (via drill 0.5)
  Top 0.254: U19.9 114.94,93.98 v55.88,93.98 | v55.88,57.15 v40.01,57.15
  Bottom 0.254: U3.11 41.27,43.81 40.01,45.09 v40.01,57.15 | v55.88,93.98 v55.88,57.15
N$90
  Top 0.254: U11.16 74.3,66.04 93.03,66.04 93.66,66.67 96.2,66.67 96.84,66.04 104.78,66.04 U17.17
  Bottom 0.254: U11.16 73.03,64.14 74.3,62.86 74.3,59.37 72.07,57.15 71.44,57.15 69.22,54.93 69.22,51.43 70.48,50.16 U10.4
N$91
  Top 0.254: U17.4 104.14,57.78 87,57.78 85.09,55.88 74.3,55.88 U10.10
  Bottom 0.254: U11.15 75.56,64.14 76.83,62.86 76.83,58.42 U10.10
N$92  (via drill 0.5)
  Top 0.254: U17.15 109.22,65.41 96.52,65.41 95.89,66.04 93.98,66.04 93.34,65.41 83.82,65.41 v83.19,64.77
  Bottom 0.254: U10.9 78.11,57.15 79.69,57.15 81.92,59.37 81.92,63.5 v83.19,64.77 U11.12
N$94  (via drill 0.5)
  Top 0.254: v114.94,62.23 97.16,62.23 95.89,60.96 93.98,60.96 93.34,61.59 76.2,61.59 v75.56,62.23
  Bottom 0.254: U10.11 U11.6 v75.56,62.23 | U17.13 116.2,64.14 114.94,62.86 v114.94,62.23
N$95
  Top 0.254: U17.8 114.3,61.59 97.47,61.59 96.2,60.32 93.66,60.32 93.03,60.96 74.3,60.96 U11.5
  Bottom 0.254: U11.5 U10.12
N$96
  Top 0.254: U17.11 118.75,64.77 96.52,64.77 95.25,63.5 81.92,63.5 80.96,64.45 70.17,64.45 U11.2
  Bottom 0.254: U11.2 65.41,58.1 64.14,56.83 64.14,51.43 65.41,50.16 U10.2
N$97
  Top 0.254: U10.8 84.77,54.61 87.31,57.15 108.58,57.15 U17.6
  Bottom 0.254: U11.9 U10.8
N$99  (via drill 0.5)
  Top 0.254: U19.7 112.39,83.82 100.97,83.82 99.69,82.55 48.9,82.55 47.62,83.82 v45.09,83.82
  Bottom 0.254: v45.09,83.82 45.09,88.27 46.35,89.54 U7.9
N$101  (via drill 0.5)
  Top 0.254: U2.2 36.2,20 37.78,18.41 84.45,18.41 v85.09,19.05 | v85.09,45.72 76.83,45.72 U10.6
  Bottom 0.254: v85.09,19.05 v85.09,45.72
N$102
  Bottom 0.254: U3.5 43.81,37.46 45.09,38.73 45.09,50.16 43.81,51.43 U4.10
N$103  (via drill 0.5)
  Top 0.254: U7.8 47.62,91.44 v24.45,91.44
  Bottom 0.254: v24.45,91.44 24.45,84.14 21.59,81.28 21.59,55.24 R5.1
N$105
  Top 0.254: Q2.2 11.43,41.91 R3.2
N$107  (via drill 0.5)
  Top 0.254: U22.10 131.44,41.91 130.18,43.18 93.34,43.18 88.27,38.1 v36.2,38.1
  Bottom 0.254: v36.2,38.1 U3.2
N$108  (via drill 0.5)
  Top 0.254: v44.45,88.9 72.39,88.9 v73.34,89.85
  Bottom 0.254: v73.34,89.85 74.3,90.81 74.3,94.62 75.56,95.89 U14.6 | U7.5 43.81,88.27 v44.45,88.9
N$111
  Bottom 0.254: U19.10 113.67,94.62 114.94,95.89 114.94,100.97 116.2,102.23 U20.9
N$112  (via drill 0.5)
  Top 0.254: v154.94,50.8 150.5,50.8 147.96,48.26 131.44,48.26 130.18,49.53 U22.2
  Bottom 0.254: U24.14 154.94,48.26 v154.94,50.8
N$114
  Top 0.254: U22.4 130.18,44.45 131.44,43.18 149.86,43.18 U24.15
  Bottom 0.254: U24.15 149.22,46.35 149.22,75.25 U25.15
N$115  (via drill 0.5)
  Top 0.254: v136.84,46.99 JP1.2
  Bottom 0.254: JP1.2 R8.2 | U22.9 136.84,41.59 v136.84,46.99
N$116
  Top 0.254: Y1.5 139.7,79.69 147.32,72.07 U25.18
  Bottom 0.254: U24.18 154.94,40.64 154.94,42.54 156.84,44.45 156.84,52.07 154.94,53.97 154.94,69.53 153.67,70.8 U25.18
N$118  (via drill 0.5)
  Top 0.254: v136.21,82.23 R9.2
  Bottom 0.254: JP2.2 R9.2 | U22.11 135.89,45.72 135.89,48.26 136.84,49.21 136.84,81.6 v136.21,82.23
N$120  (via drill 0.5)
  Top 0.254: U20.4 108.58,95.25 v118.75,95.25 | U18.5 109.86,71.12 116.52,71.12 v118.75,73.34
  Bottom 0.254: v118.75,95.25 v118.75,73.34
N$122
  Bottom 0.254: J5.1 163.83,92.39 165.1,91.12 165.1,86.04 U25.38
N$123
  Bottom 0.254: U25.35 167.64,83.5 167.64,91.12 166.37,92.39 J5.2
N$124
  Top 0.254: Q3.2 11.43,52.7 R5.2
N$125
  Bottom 0.254: J4.1 163.83,59.69 165.1,58.42 165.1,53.34 U24.38
N$126
  Top 0.254: Q1.2 11.43,33.66 R2.2
N$131  (via drill 0.5)
  Top 0.254: U5.9 44.77,65.72 v34.92,65.72
  Bottom 0.254: v34.92,65.72 34.92,64.14 33.66,62.86 U5.1
N$132
  Top 0.254: U6.8 46.99,81.92 34.29,81.92 33.66,81.28 14.61,81.28 U1.2
N$133
  Top 0.254: U1.7 U1.6 | R7.2 15.88,95.25 U1.6 | C29.+ 14.61,91.44 U1.6
N$136
  Bottom 0.254: U24.35 167.64,50.8 167.64,58.42 166.37,59.69 J4.2
N$137  (via drill 0.5)
  Top 0.254: U4.13 34.92,55.88 v26.04,55.88 | v26.04,83.19 15.24,83.19 U1.3 | v26.04,33.66 R2.1
  Bottom 0.254: v26.04,83.19 v26.04,55.88 v26.04,33.66
N$140
  Bottom 0.254: C28.P$1 15.88,90.17 U1.5
S$1
  pour Top: 10.87,104.53 11.86,104.53 12.97,105.56 13.53,104.53 14.58,104.53 13.63,106.16 15.41,107.79 14.43,107.79 13.3,106.75 12.74,107.79 11.7,107.79 12.64,106.13
  pour Top: 21.56,107.79 22.44,107.79 21.6,104.53 20.72,104.53
  pour Top: 27.6,107.79 28.3,107.1 28.12,106.39 30.23,106.39 30.41,107.1 28.32,107.1 27.62,107.79 30.75,107.79 arc-55 31.17,107.58 arc-31 31.28,107.32 arc-18 31.25,107 31.14,106.58 arc-18 31.06,106.4 arc-18 30.75,106 arc-19 30.44,105.8 arc-14 30.09,105.74 30.52,104.53 29.65,104.53 29.21,105.75 27.94,105.75 27.62,104.53 26.75,104.53
  pour Top: 15.17,104.53 16.01,107.79 20.29,107.79 arc-50 20.62,107.66 arc-37 20.75,107.37 arc-17 20.72,106.99 20.08,104.53 19.21,104.53 19.88,107.1 18.74,107.1 18.07,104.53 17.19,104.53 17.86,107.1 16.72,107.1 16.05,104.53
  pour Top: 32.83,107.1 34.92,107.1 34.42,105.22 32.3,105.22 32.8,107.1 32.85,107.79 32.75,107.79 arc33 32.36,107.65 arc19 32.07,107.33 arc18 31.89,106.95 31.47,105.35 arc9 31.45,105.25 arc9 31.44,105.01 arc22 31.48,104.8 arc36 31.61,104.62 arc17 31.73,104.55 arc13 31.87,104.53 34.45,104.53 arc18 34.66,104.55 arc16 34.84,104.65 arc14 35.08,104.87 arc26 35.33,105.34 35.77,107.01 arc17 35.79,107.29 arc19 35.75,107.51 arc66 35.37,107.79 32.88,107.79
SHIELD
  pour Bottom: 203.2,99.06 190.82,99.06 190.82,17.78 203.2,17.78
  pour Top: 203.2,99.06 190.82,99.06 190.82,17.78 203.2,17.78
UC4
  Bottom 0.254: U11.8 80.64,63.5 81.92,64.77 81.92,67.63 79.06,70.48 75.88,70.48 74.3,72.07 74.3,75.56 73.03,76.84 U12.10
VCC  (via drill 0.5)
  Top 0.254: U20.16 99.69,106.68 102.23,106.68 U20.14 U20.13 U20.12 U20.11 U20.10 | U14.2 66.67,99.06 69.22,99.06 U14.4 | U14.14 64.14,106.68 67.94,106.68 | 67.94,106.68 71.75,106.68 U14.10 | U14.12 67.94,106.68 | U5.4 40.01,60.96 37.47,60.96 U5.2 34.61,58.1 v33.02,58.1 | U6.10 42.55,81.28 38.73,81.28 | 38.73,81.28 34.92,81.28 U6.14 | U6.12 38.73,81.28 | Y1.1 Y1.8 | v37.47,27.3 35.56,27.3 U2.14
  Top 0.406: R1.2 24.13,25.4 25.4,26.67 C2.P$1 | R6.2 23.5,55.24 24.13,54.61 U4.14
  Top 0.61: U1.8 5.71,90.17 C1.P$1 | U1.4 16.51,84.45 24.13,84.45 C7.P$1 | 160.02,19.05 184.78,19.05 187.32,21.59 C33.P$1 191.77,20.96 195.18,20.96 J3.4
  Top 0.813: 161.29,64.45 C24.P$1 | 125.73,20.32 C21.P$1 | C23.P$1 160.02,19.05 U23.20 | U21.20 129.54,20.32 | 161.29,97.47 C25.P$1 | 97.95,20.32 v97.31,20.96 v96.52,20.96
  Top 1.016: 154.62,19.05 130.81,19.05 129.54,20.32 125.73,20.32 121.92,20.32 C30.+ 116.84,20.32 97.95,20.32 95.89,20.32 | 154.62,19.05 C23.P$1 v155.42,19.84 154.62,19.05 | 173.2,64.45 v174.15,64.45 v174.15,63.5 173.2,64.45 | 173.2,64.45 161.29,64.45 134.78,64.45 | 158.27,35.56 v157,35.56 v157.64,34.92 158.27,35.56 | 158.27,35.56 176.69,35.56 | 176.69,35.56 C26.P$1 v177.8,36.67 176.69,35.56 | 173.51,97.47 v174.78,97.47 v174.15,96.84 173.51,97.47 | 173.51,97.47 161.29,97.47 137.16,97.47 133.35,93.66 | v96.52,20.96 95.89,20.32 | 95.89,20.32 88.9,20.32 85.09,16.51 62.39,16.51 | 62.39,16.51 60.33,16.51 | 60.33,16.51 v60.96,17.14 v61.75,17.14 62.39,16.51 | 60.33,16.51 36.04,16.51 33.02,19.53 | 134.78,64.45 v133.99,64.45 v133.99,63.66 134.78,64.45 | 133.35,93.66 C31.P$1 v133.35,92.39 133.35,93.66 | 33.02,19.53 v32.38,20.16 v31.75,19.53 33.02,19.53
  Top 1.524: v119.38,10.16 v119.38,9.21 v119.38,8.26 CE0.6
  Bottom 0.254: U20.3 U20.14 | U14.2 64.14,96.52 60.96,96.52 | U6.4 41.27,74.93 38.73,77.47 U6.12 | v33.02,58.1 31.75,58.1 | v37.47,27.3 41.27,23.5 U2.4 U2.5 | U7.14 U7.13 U7.12
  Bottom 0.406: 101.12,39.05 103.35,39.05 | 103.66,39.05 105.89,39.05 | 106.2,39.05 108.43,39.05 | 108.74,39.05 110.97,39.05 | 111.28,39.05 113.51,39.05 | 113.82,39.05 116.05,39.05 | 116.36,39.05 118.59,39.05 | 100.81,39.05 96.52,39.05 96.52,38.73 | R4.2 17.78,45.72 17.78,53.97 R6.2
  Bottom 0.61: U1.4 U1.8 R7.1
  Bottom 0.813: C15.P$1 96.52,39.37 | 96.52,67.31 U17.20 | C17.P$1 96.52,64.77 | C16.P$1 96.52,52.07 | U16.20 96.52,54.61 | 96.52,41.91 U15.20 RN1.1 | C8.P$1 60.96,26.67 | 60.96,54.61 U10.14 | C10.P$1 60.96,52.07 | U9.16 60.96,41.91 | C9.P$1 60.96,39.37 | U8.16 60.96,29.21 | U20.16 97.16,105.41 96.52,104.78 96.52,102.87 C20.P$1 | C19.P$1 96.52,90.17 | U19.16 96.52,92.71 | U18.14 96.52,80.01 | C18.P$1 96.52,77.47 | 60.96,104.78 61.59,105.41 U14.14 | C14.P$1 60.96,102.87 | C13.P$1 60.96,90.17 | U13.14 60.96,92.71 | U12.14 60.96,80.01 | C12.P$1 60.96,77.47 | C11.P$1 60.96,64.77 | U11.20 60.96,67.31 | C24.P$1 U24.44 | C25.P$1 U25.44 | 100.81,39.05 101.12,39.05 | 103.35,39.05 103.66,39.05 | 105.89,39.05 106.2,39.05 | 108.43,39.05 108.74,39.05 | 110.97,39.05 111.28,39.05 | 113.51,39.05 113.82,39.05 | 116.05,39.05 116.36,39.05 | 118.59,39.05 118.9,39.05 | C2.P$1 31.75,26.67 | U7.14 32.38,92.71 31.75,92.08 31.75,90.17 C7.P$1 | C6.P$1 31.75,77.47 | U6.14 31.75,80.01 | C5.P$1 31.75,64.77 | U5.14 31.75,67.31 | U4.14 31.75,54.61 | C4.P$1 31.75,52.07 | C3.P$1 31.75,39.37 | U3.14 31.75,41.91 | U2.14 31.75,29.21 | 132.08,52.07 U22.14 | Y1.8 132.08,87.31 | v133.99,64.45 v133.99,63.66 | 133.35,55.88 C22.P$1 | 174.78,72.07 U27.20 C27.P$1 | U26.20 v177.8,36.67
  Bottom 1.016: 96.52,102.87 96.52,92.71 96.52,90.17 96.52,80.01 96.52,77.47 96.52,67.31 96.52,64.77 96.52,54.61 96.52,52.07 96.52,41.91 96.52,39.37 96.52,38.73 96.52,21.75 | 60.96,104.78 60.96,102.87 60.96,96.52 60.96,92.71 60.96,90.17 60.96,80.01 60.96,77.47 60.96,67.31 60.96,64.77 60.96,54.61 60.96,52.07 60.96,41.91 60.96,39.37 60.96,29.21 60.96,26.67 60.96,17.94 | 156.21,20.64 v155.42,19.84 C23.P$1 156.21,20.64 | 156.21,20.64 156.21,22.54 157,23.34 157,34.29 | 157,34.29 v157,35.56 v157.64,34.92 157,34.29 | 174.78,62.86 174.78,38.58 176.69,36.67 | 174.78,62.86 v174.15,63.5 v174.15,64.45 174.78,65.09 | 174.78,96.2 v174.15,96.84 v174.78,97.47 174.78,96.2 | 174.78,96.2 174.78,72.07 174.78,65.09 | 174.78,62.86 174.78,65.09 | 96.52,21.75 v96.52,20.96 v97.31,20.96 96.52,21.75 | 60.96,17.94 v60.96,17.14 v61.75,17.14 60.96,17.94 | 132.08,91.12 132.08,87.31 132.08,79.06 133.35,77.79 133.35,65.09 | 132.08,91.12 C31.P$1 v133.35,92.39 132.08,91.12 | 31.75,90.17 31.75,80.01 31.75,77.47 31.75,67.31 31.75,64.77 31.75,58.1 31.75,54.61 31.75,52.07 31.75,41.91 31.75,39.37 31.75,29.21 31.75,26.67 31.75,20.8 | 31.75,20.8 v31.75,19.53 v32.38,20.16 31.75,20.8 | 133.35,63.02 133.35,65.09 | 133.35,65.09 v133.99,64.45 | v133.99,63.66 133.35,63.02 | 133.35,63.02 133.35,55.88 133.35,54.61 132.08,53.34 132.08,52.07 132.08,35.56 119.38,22.86 C30.+ | 176.69,36.67 C26.P$1 v177.8,36.67 176.69,36.67
  Bottom 1.524: CE0.6 v119.38,8.26 v119.38,9.21 v119.38,10.16 C30.+

## Text on the board
tPlace: CHRIS WEIR 2019
bPlace: CARD ID | 1 | 0 | 0 | 1 | 2 | 3 | 4 | 5 | 6 | 7
tNames: XMICRO-SERIAL
tValues: V1.1 1912
tDocu: Edge of case